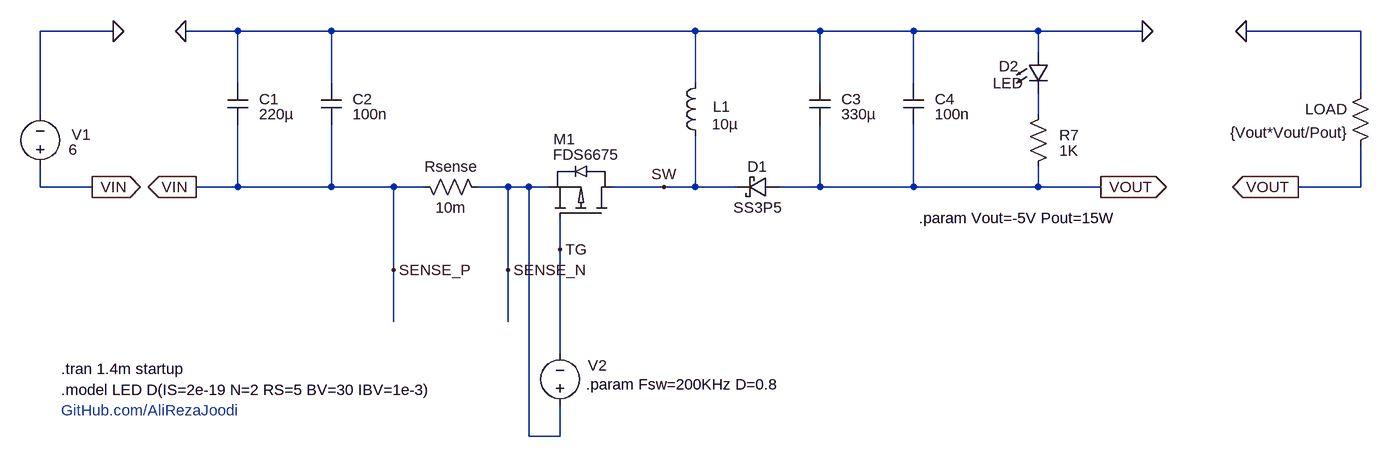
[diagram p0: schematic _PowerStage_PMOS_v1.0.asc]
_PowerStage_PMOS_v1.0.asc, the LTspice schematic file:
Version 4.1
SHEET 1 3996 1504
WIRE 1664 96 1552 96
WIRE 1856 96 1776 96
WIRE 2000 96 1856 96
WIRE 2560 96 2000 96
WIRE 2752 96 2560 96
WIRE 2896 96 2752 96
WIRE 3088 96 2896 96
WIRE 3248 96 3088 96
WIRE 3584 96 3408 96
WIRE 3088 128 3088 96
WIRE 1856 176 1856 96
WIRE 2000 176 2000 96
WIRE 2560 176 2560 96
WIRE 2752 176 2752 96
WIRE 2896 176 2896 96
WIRE 3584 192 3584 96
WIRE 1552 224 1552 96
WIRE 3088 224 3088 192
WIRE 1552 336 1552 304
WIRE 1632 336 1552 336
WIRE 1856 336 1856 240
WIRE 1856 336 1792 336
WIRE 2000 336 2000 240
WIRE 2000 336 1856 336
WIRE 2096 336 2000 336
WIRE 2144 336 2096 336
WIRE 2272 336 2224 336
WIRE 2304 336 2272 336
WIRE 2336 336 2304 336
WIRE 2512 336 2432 336
WIRE 2560 336 2560 256
WIRE 2560 336 2512 336
WIRE 2624 336 2560 336
WIRE 2752 336 2752 240
WIRE 2752 336 2688 336
WIRE 2896 336 2896 240
WIRE 2896 336 2752 336
WIRE 3088 336 3088 304
WIRE 3088 336 2896 336
WIRE 3184 336 3088 336
WIRE 3584 336 3584 272
WIRE 3584 336 3488 336
WIRE 2352 432 2352 384
WIRE 2096 464 2096 336
WIRE 2272 464 2272 336
WIRE 2096 544 2096 464
WIRE 2272 544 2272 464
WIRE 2352 592 2352 432
WIRE 2304 720 2304 336
WIRE 2352 720 2352 672
WIRE 2352 720 2304 720
FLAG 3408 96 0
FLAG 3184 336 VOUT
IOPIN 3184 336 Out
FLAG 1632 336 VIN
IOPIN 1632 336 Out
FLAG 2512 336 SW
FLAG 2352 432 TG
FLAG 3248 96 0
FLAG 2096 464 SENSE_P
FLAG 2272 464 SENSE_N
FLAG 1792 336 VIN
IOPIN 1792 336 Out
FLAG 3488 336 VOUT
IOPIN 3488 336 Out
FLAG 1776 96 0
FLAG 1664 96 0
SYMBOL ind 2576 272 R180
WINDOW 0 -38 60 Left 2
WINDOW 3 -50 33 Left 2
SYMATTR InstName L1
SYMATTR Value 10µ
SYMATTR SpiceLine Rser=0.025
SYMBOL res 2128 320 M90
WINDOW 0 0 56 VBottom 2
WINDOW 3 32 56 VTop 2
SYMATTR InstName Rsense
SYMATTR Value 10m
SYMATTR SpiceLine tol=1
SYMBOL voltage 1552 320 M180
WINDOW 123 24 138 Left 2
WINDOW 39 24 117 Left 2
WINDOW 3 44 42 Left 2
WINDOW 0 48 65 Left 2
SYMATTR Value 6
SYMATTR InstName V1
SYMBOL res 3600 176 M0
SYMATTR InstName LOAD
SYMATTR Value {Vout*Vout/Pout}
SYMBOL cap 1984 240 M180
WINDOW 0 49 39 Left 2
WINDOW 3 49 16 Left 2
SYMATTR InstName C2
SYMATTR Value 100n
SYMATTR SpiceLine V=35
SYMBOL cap 2880 240 M180
WINDOW 0 49 39 Left 2
WINDOW 3 49 16 Left 2
SYMATTR InstName C4
SYMATTR Value 100n
SYMBOL schottky 2688 320 R90
WINDOW 0 0 32 VBottom 2
WINDOW 3 32 32 VTop 2
SYMATTR InstName D1
SYMATTR Value SS3P5
SYMBOL LED 3072 128 R0
WINDOW 0 -45 22 Left 2
WINDOW 3 -54 48 Left 2
SYMATTR InstName D2
SYMATTR Value LED
SYMBOL res 3072 320 M180
WINDOW 0 48 64 Left 2
WINDOW 3 48 40 Left 2
SYMATTR InstName R7
SYMATTR Value 1K
SYMBOL cap 1840 240 M180
WINDOW 0 49 39 Left 2
WINDOW 3 49 16 Left 2
SYMATTR InstName C1
SYMATTR Value 220µ
SYMATTR SpiceLine V=35
SYMBOL voltage 2352 688 M180
WINDOW 3 39 69 Invisible 2
WINDOW 123 0 0 Left 0
WINDOW 0 43 77 Left 2
SYMATTR Value PULSE(0 12 0 {0.01/Fsw} {0.01/Fsw} {D/Fsw} {1/Fsw})
SYMATTR InstName V2
SYMATTR SpiceLine Rser=10
SYMBOL cap 2736 240 M180
WINDOW 0 49 39 Left 2
WINDOW 3 49 16 Left 2
SYMATTR InstName C3
SYMATTR Value 330µ
SYMATTR SpiceLine V=35
SYMBOL MyLib\\Transistor_MOSFET_P\\MOSFET_P 2336 384 R270
WINDOW 0 122 6 VRight 2
WINDOW 3 98 5 VRight 2
SYMATTR InstName M1
SYMATTR Value FDS6675
TEXT 1584 616 Left 2 !.tran 1.4m startup
TEXT 1584 648 Left 2 !.model LED D(IS=2e-19 N=2 RS=5 BV=30 IBV=1e-3)
TEXT 1584 680 Left 2 ;GitHub.com/AliRezaJoodi
TEXT 2904 384 Left 2 !.param Vout=-5V Pout=15W
TEXT 2392 640 Left 2 !.param Fsw=200KHz D=0.8

The netlist it stands for:
* _PowerStage_PMOS_v1.0.asc
L1 SW 0 10µ Rser=0.025
Rsense SENSE_P SENSE_N 10m tol=1
V1 SENSE_P 0 6
R§LOAD 0 VOUT {Vout*Vout/Pout}
C2 SENSE_P 0 100n V=35
C4 VOUT 0 100n
D1 VOUT SW SS3P5
D2 0 N001 LED
R7 VOUT N001 1K
C1 SENSE_P 0 220µ V=35
V2 SENSE_N TG PULSE(0 12 0 {0.01/Fsw} {0.01/Fsw} {D/Fsw} {1/Fsw}) Rser=10
C3 VOUT 0 330µ V=35
M1 SW TG SENSE_N SENSE_N FDS6675
.model D D
.lib standard.dio
.model NMOS NMOS
.model PMOS PMOS
.lib standard.mos
.tran 1.4m startup
.model LED D(IS=2e-19 N=2 RS=5 BV=30 IBV=1e-3)
* GitHub.com/AliRezaJoodi
.param Vout=-5V Pout=15W
.param Fsw=200KHz D=0.8
.backanno
.end